# Altium project untitled.PrjPcb
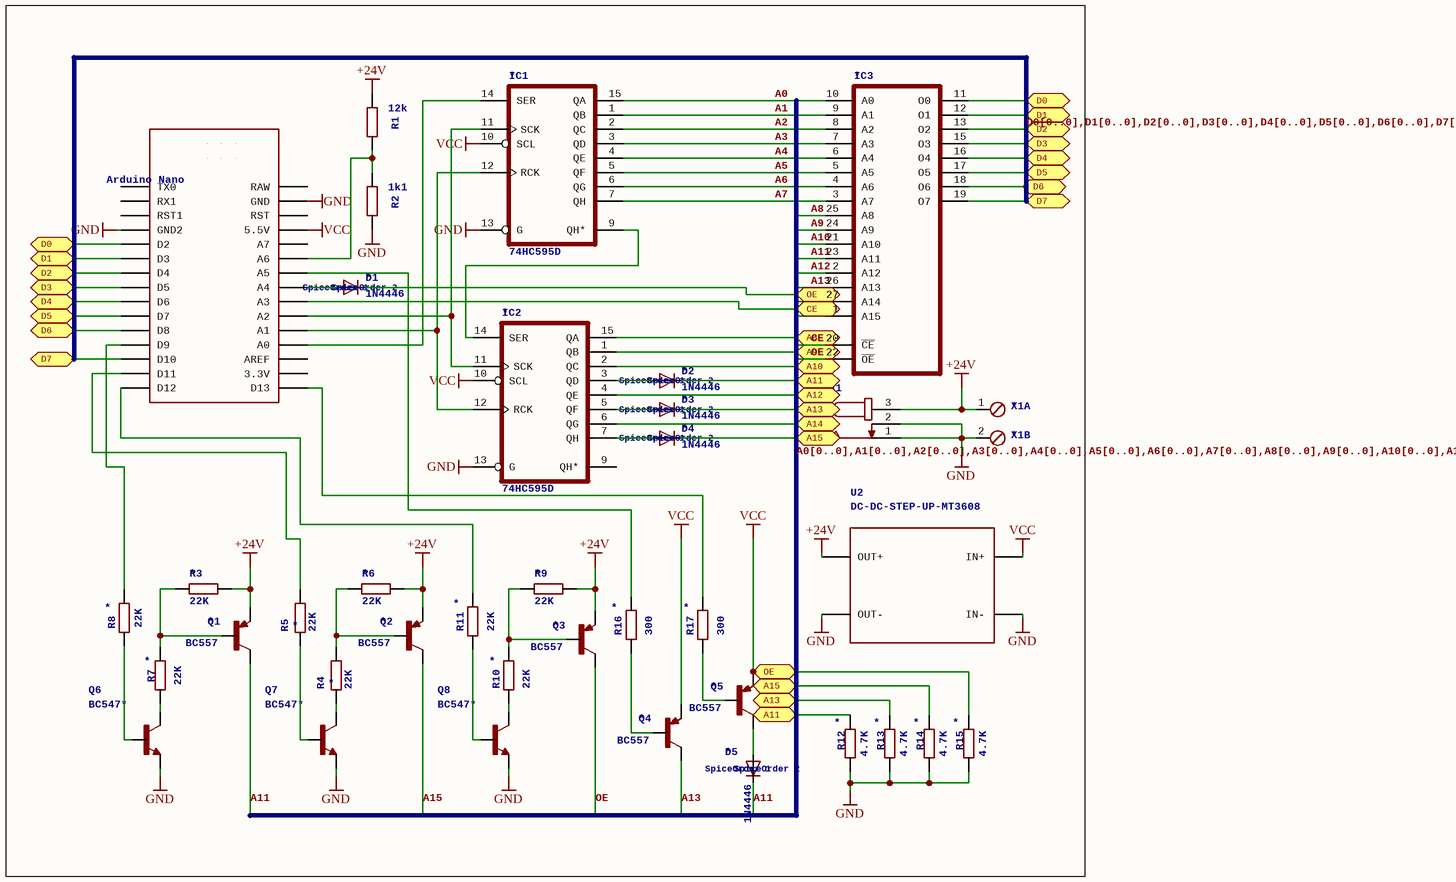
[diagram p0: untitled.SchDoc]
1 sheet, 37 parts. Net scope: flat (ports and power ports of the same name join across sheets).
Board file: untitled.PcbDoc

## Sheet untitled.SchDoc
size 190 x 153 mm

### Parts
D1  1N4446  SpiceOrder1: SpiceOrder 1  SpiceOrder2: SpiceOrder 2  [DO35-10]
D2  1N4446  SpiceOrder1: SpiceOrder 1  SpiceOrder2: SpiceOrder 2  [DO35-10]
D3  1N4446  SpiceOrder1: SpiceOrder 1  SpiceOrder2: SpiceOrder 2  [DO35-10]
D4  1N4446  SpiceOrder1: SpiceOrder 1  SpiceOrder2: SpiceOrder 2  [DO35-10]
D5  1N4446  SpiceOrder1: SpiceOrder 1  SpiceOrder2: SpiceOrder 2  [DO35-10]
IC1  74HC595D  [SO16]
IC2  74HC595D  [SO16]
IC3  27512  [DIL28]  (value not drawn)
J1  JACK-PLUG1  [SPC4078]  (value not drawn)
Q1  BC557  [TO92]
Q2  BC557  [TO92]
Q3  BC557  [TO92]
Q4  BC557  [TO92]
Q5  BC557  [TO92]
Q6  BC547*  [TO92]
Q7  BC547*  [TO92]
Q8  BC547*  [TO92]
R1  NAME: 12k  [M0805]  (hidden comment: R-EU_M0805)
R2  NAME: 1k1  [M0805]  (hidden comment: R-EU_M0805)
R3  22K  [M0805]
R4  22K  [M0805]
R5  22K  [M0805]
R6  22K  [M0805]
R7  22K  [M0805]
R8  22K  [M0805]
R9  22K  [M0805]
R10  22K  [M0805]
R11  22K  [M0805]
R12  4.7K  [M0805]
R13  4.7K  [M0805]
R14  4.7K  [M0805]
R15  4.7K  [M0805]
R16  300  [M0805]
R17  300  [M0805]
U1  NANO  [NANO]  (value not drawn)
U2  DC-DC-STEP-UP-MT3608  [DC-DC-STEP-UP-MT3608]
X1  MPT2  [2POL254]  (value not drawn)  (parts A,B of 2)

### Ports
A8, A9, A10, A11, A12, A13, A14, A15, CE, D0, D1, D2, D3, D4, D5, D6, D7, OE

### Nets
+24V: J1.3 Q1.1(E) Q2.1(E) Q3.1(E) R1.1 R3.2 R6.2 R9.2 U2.OUT+ X1.1
GND: IC1.13(G) IC2.13(G) J1.1 J1.2 Q6.1(E) Q7.1(E) Q8.1(E) R2.2 R12.2 R13.2 R14.2 R15.2 U1.GND U1.GND1(GND2) U2.IN- U2.OUT- X1.2
VCC: D1.C IC1.10(SCL) IC2.10(SCL) Q4.1(E) Q5.1(E) R15.1 U1.5V(5.5V) U2.IN+ ; port OE
A0: IC1.15(QA) IC3.10(A0)
A1: IC1.1(QB) IC3.9(A1)
A2: IC1.2(QC) IC3.8(A2)
A3: IC1.3(QD) IC3.7(A3)
A4: IC1.4(QE) IC3.6(A4)
A5: IC1.5(QF) IC3.5(A5)
A6: IC1.6(QG) IC3.4(A6)
A7: IC1.7(QH) IC3.3(A7)
A8: IC3.25(A8)
A9: IC3.24(A9)
A10: IC3.21(A10)
A11: D5.C IC3.23(A11) Q1.3(C)
A12: IC3.2(A12)
A13: IC3.26(A13) Q4.3(C)
A14: IC3.27(A14)
A15: IC3.1(A15) Q2.3(C)
CE: IC3.20(~{CE})
D0[0..0],D1[0..0],D2[0..0],D3[0..0],D4[0..0],D5[0..0],D6[0..0],D7[0..0]: IC3.13(O2) U1.D4 ; port D2
OE: IC3.22(~{OE}) Q3.3(C)
NetD1_A: D1.A U1.A4
NetD2_A: D2.A IC2.3(QD)
NetD2_C: D2.C R12.1 ; port A11
NetD3_A: D3.A IC2.5(QF)
NetD3_C: D3.C R13.1 ; port A13
NetD4_A: D4.A IC2.7(QH)
NetD4_C: D4.C R14.1 ; port A15
NetD5_A: D5.A Q5.3(C)
NetIC1_9: IC1.9(QH*) IC2.14(SER)
NetIC1_11: IC1.11(SCK) IC2.11(SCK) U1.A2
NetIC1_12: IC1.12(RCK) IC2.12(RCK) U1.A1
NetIC1_14: IC1.14(SER) U1.A0
NetIC2_1: IC2.1(QB) ; port A9
NetIC2_2: IC2.2(QC) ; port A10
NetIC2_4: IC2.4(QE) ; port A12
NetIC2_6: IC2.6(QG) ; port A14
NetIC2_15: IC2.15(QA) ; port A8
NetIC3_11: IC3.11(O0) U1.D2 ; port D0
NetIC3_12: IC3.12(O1) U1.D3 ; port D1
NetIC3_15: IC3.15(O3) U1.D5 ; port D3
NetIC3_16: IC3.16(O4) U1.D6 ; port D4
NetIC3_17: IC3.17(O5) U1.D7 ; port D5
NetIC3_18: IC3.18(O6) U1.D8 ; port D6
NetIC3_19: IC3.19(O7) U1.D10 ; port D7
NetQ1_2: Q1.2(B) R3.1 R7.1
NetQ2_2: Q2.2(B) R4.2 R6.1
NetQ3_2: Q3.2(B) R9.1 R10.1
NetQ4_2: Q4.2(B) R16.2
NetQ5_2: Q5.2(B) R17.2
NetQ6_2: Q6.2(B) R8.2
NetQ6_3: Q6.3(C) R7.2
NetQ7_2: Q7.2(B) R5.1
NetQ7_3: Q7.3(C) R4.1
NetQ8_2: Q8.2(B) R11.2
NetQ8_3: Q8.3(C) R10.2
NetR1_2: R1.2 R2.1 U1.A6
NetR5_2: R5.2 U1.D11
NetR8_1: R8.1 U1.D9
NetR11_1: R11.1 U1.D12
NetR16_1: R16.1 U1.A5
NetR17_1: R17.1 U1.D13
NetU1_A3: U1.A3 ; port CE

Not connected (* = marked no-connect by the designer): IC2 9(QH*); U1 3.3V A7 AREF ICSP1 ICSP2 ICSP3 ICSP4 ICSP5 ICSP6 RAW RST RST1 RX1 TX0

### Buses and harness runs
bus A0[0..0],A1[0..0],A2[0..0],A3[0..0],A4[0..0],A5[0..0],A6[0..0],A7[0..0],A8[0..0],A9[0..0],A10[0..0],A11[0..0],A12[0..0],A13[0..0],A14[0..0],A15[0..0],CE[0..0],OE[0..0]

### Library data of the parts
D1-D5 = 1N4446: DIODE   high speed (Philips); NAME: *
IC1 IC2 = 74*595D: 8-bit SHIFT REGISTER, output latch; NAME: *
IC3 = 27512: MEMORY; NAME: *
J1 = JACK-PLUG1: DC POWER JACK Power Jack, DC, Right Angle, Through Hole, Rated 5A at 16VDC, PC Terminals   Distributor: Farnell (www.Farnell.de) Drawing: 84N1161.pdf / 84N1162.pdf Manufacturer: SPC Technology (www.spctechnology.com) Type: SPC4077 / SPC 4078; MF: *; MPN: *; NAME: *; OC_FARNELL: unknown; OC_NEWARK: unknown
Q1-Q5 = BC557: PNP Transistor; NAME: *
Q6-Q8 = BC547*: NPN Transistor
R1-R17 = R-EU_M0805: RESISTOR, European symbol; SPICEPREFIX: R
  R3-R17: NAME: *
U1 = NANO: Arduino Nano; ArduinoNano: Arduino Nano
U2 = DC-DC-STEP-UP-MT3608: DC/DC Step-Up Regulator based on MT3608 chip    MT3608 datasheet available here: https://www.olimex.com/Products/Breadboarding/BB-PWR-3608/resources/MT3608.pdf   Click here to find device on ebay.com
X1 = MPT2: PHOENIX CONNECTOR; MF: *; MPN: *; NAME: *; OC_FARNELL: unknown; OC_NEWARK: unknown